# Altium schematic sheet Sheet2.SchDoc
size A4; SheetNumber: 1; SheetTotal: 1
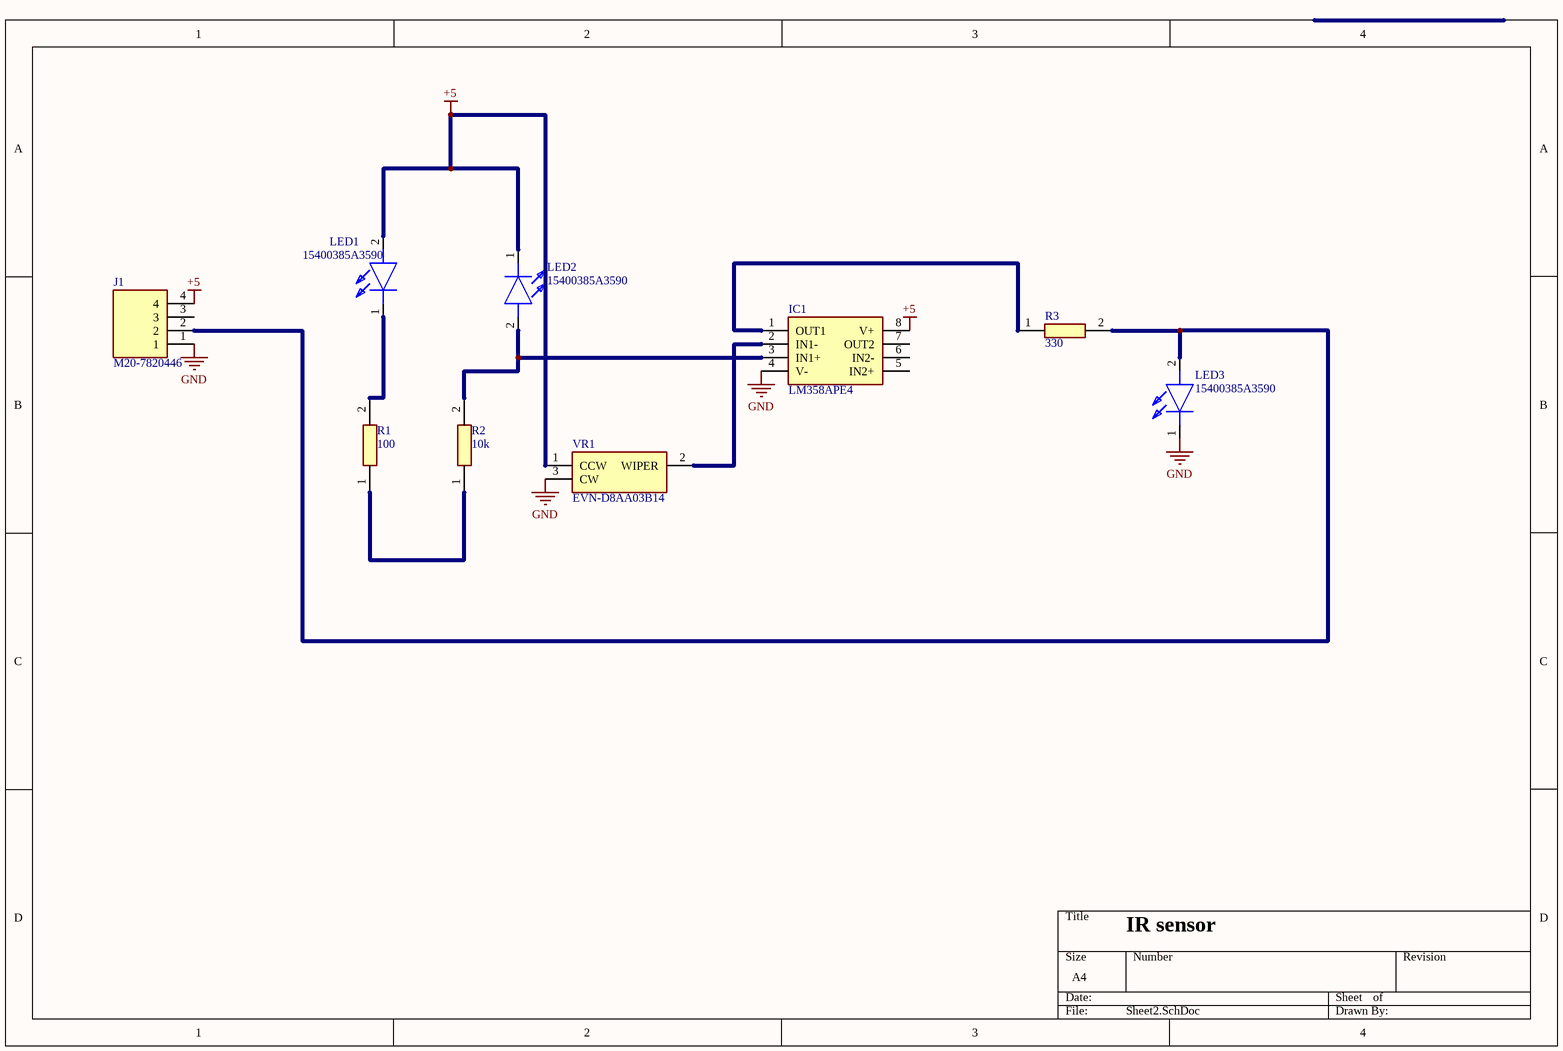
[diagram p0: Sheet2.SchDoc]

## Parts
IC1  LM358APE4  [DIP794W53P254L959H508Q8N]
J1  M20-7820446  [RHDR4W70P0X254_1X4_1056X250X865P]
LED1  15400385A3590  [15400385A3590]
LED2  15400385A3590  [15400385A3590]
LED3  15400385A3590  [15400385A3590]
R1  100  [RESAD1630W60L710D230]
R2  10k  [RESAD1630W60L710D230]
R3  330  [RESAD1630W60L710D230]
VR1  EVN-D8AA03B14  [EVND8AA03B14]

## Nets
+5: IC1.8(V+) J1.4 LED1.2(A) LED2.1(K) VR1.1(CCW)
GND: IC1.4(V-) J1.1 LED3.1(K) VR1.3(CW)
NetIC1_1: IC1.1(OUT1) R3.1
NetIC1_2: IC1.2(IN1-) VR1.2(WIPER)
NetIC1_3: IC1.3(IN1+) LED2.2(A) R2.2
NetJ1_2: J1.2 LED3.2(A) R3.2
NetLED1_1: LED1.1(K) R1.2
NetR1_1: R1.1 R2.1

Not connected (* = marked no-connect by the designer): IC1 5(IN2+) 6(IN2-) 7(OUT2); J1 3

## Notes on the sheet
- IR sensor

## Library data of the parts
IC1 = LM358APE4: Integrated Circuit; Manufacturer_Name: Texas Instruments; Datasheet Link: http://www.ti.com/lit/ds/symlink/lm358a.pdf; Height: 5.08mm; Manufacturer_Part_Number: LM358APE4; Mouser Part Number: 595-LM358APE4; Mouser Price/Stock: https://www.mouser.co.uk/ProductDetail/Texas-Instruments/LM358APE4?qs=VBduBm9rCJTOdx3RyeRhNA%3D%3D; Arrow Part Number: LM358APE4; Arrow Price/Stock: https://www.arrow.com/en/products/lm358ape4/texas-instruments?region=nac
J1 = M20-7820446: Connector; Manufacturer_Name: Harwin; Datasheet Link: https://cdn.harwin.com/pdfs/M20-782.pdf; Height: 8.65mm; Manufacturer_Part_Number: M20-7820446; Mouser Part Number: 855-M20-7820446; Mouser Price/Stock: https://www.mouser.co.uk/ProductDetail/Harwin/M20-7820446?qs=vF78I%252BjhbY8%252Bno0H8mp9XA%3D%3D
LED1-LED3 = 15400385A3590: LED; Manufacturer_Name: Wurth Elektronik; Datasheet Link: https://www.we-online.com/katalog/datasheet/15400385A3590.pdf; Height: 10.9mm; Manufacturer_Part_Number: 15400385A3590; Mouser Part Number: 710-15400385A3590; Mouser Price/Stock: https://www.mouser.co.uk/ProductDetail/Wurth-Elektronik/15400385A3590?qs=5aG0NVq1C4yszs1ddn0oOg%3D%3D
R1-R3 = MF1_4DCT26A1001F: Resistor; Manufacturer_Name: KOA Speer; Manufacturer_Part_Number: MF1/4DCT26A1001F; Datasheet Link: https://componentsearchengine.com/Datasheets/1/MF1_4DCT26A1001F.pdf; Mouser Part Number: 660-MF1/4DCT26A1001F; Mouser Price/Stock: https://www.mouser.co.uk/ProductDetail/KOA-Speer/MF1-4DCT26A1001F?qs=wVGympPcmnD9Oav1Pii0SQ%3D%3D
VR1 = EVN-D8AA03B14: Variable Resistor; Manufacturer_Name: Panasonic; Datasheet Link: https://componentsearchengine.com/Datasheets/1/EVN-D8AA03B14.pdf; Height: 6.45mm; Manufacturer_Part_Number: EVN-D8AA03B14; Mouser Part Number: 667-EVN-D8AA03B14; Mouser Price/Stock: https://www.mouser.co.uk/ProductDetail/Panasonic/EVN-D8AA03B14?qs=WwqriLBepZsROPwYCdkbeA%3D%3D